# EAGLE design DC-PSx (EAGLE 9.6.2)
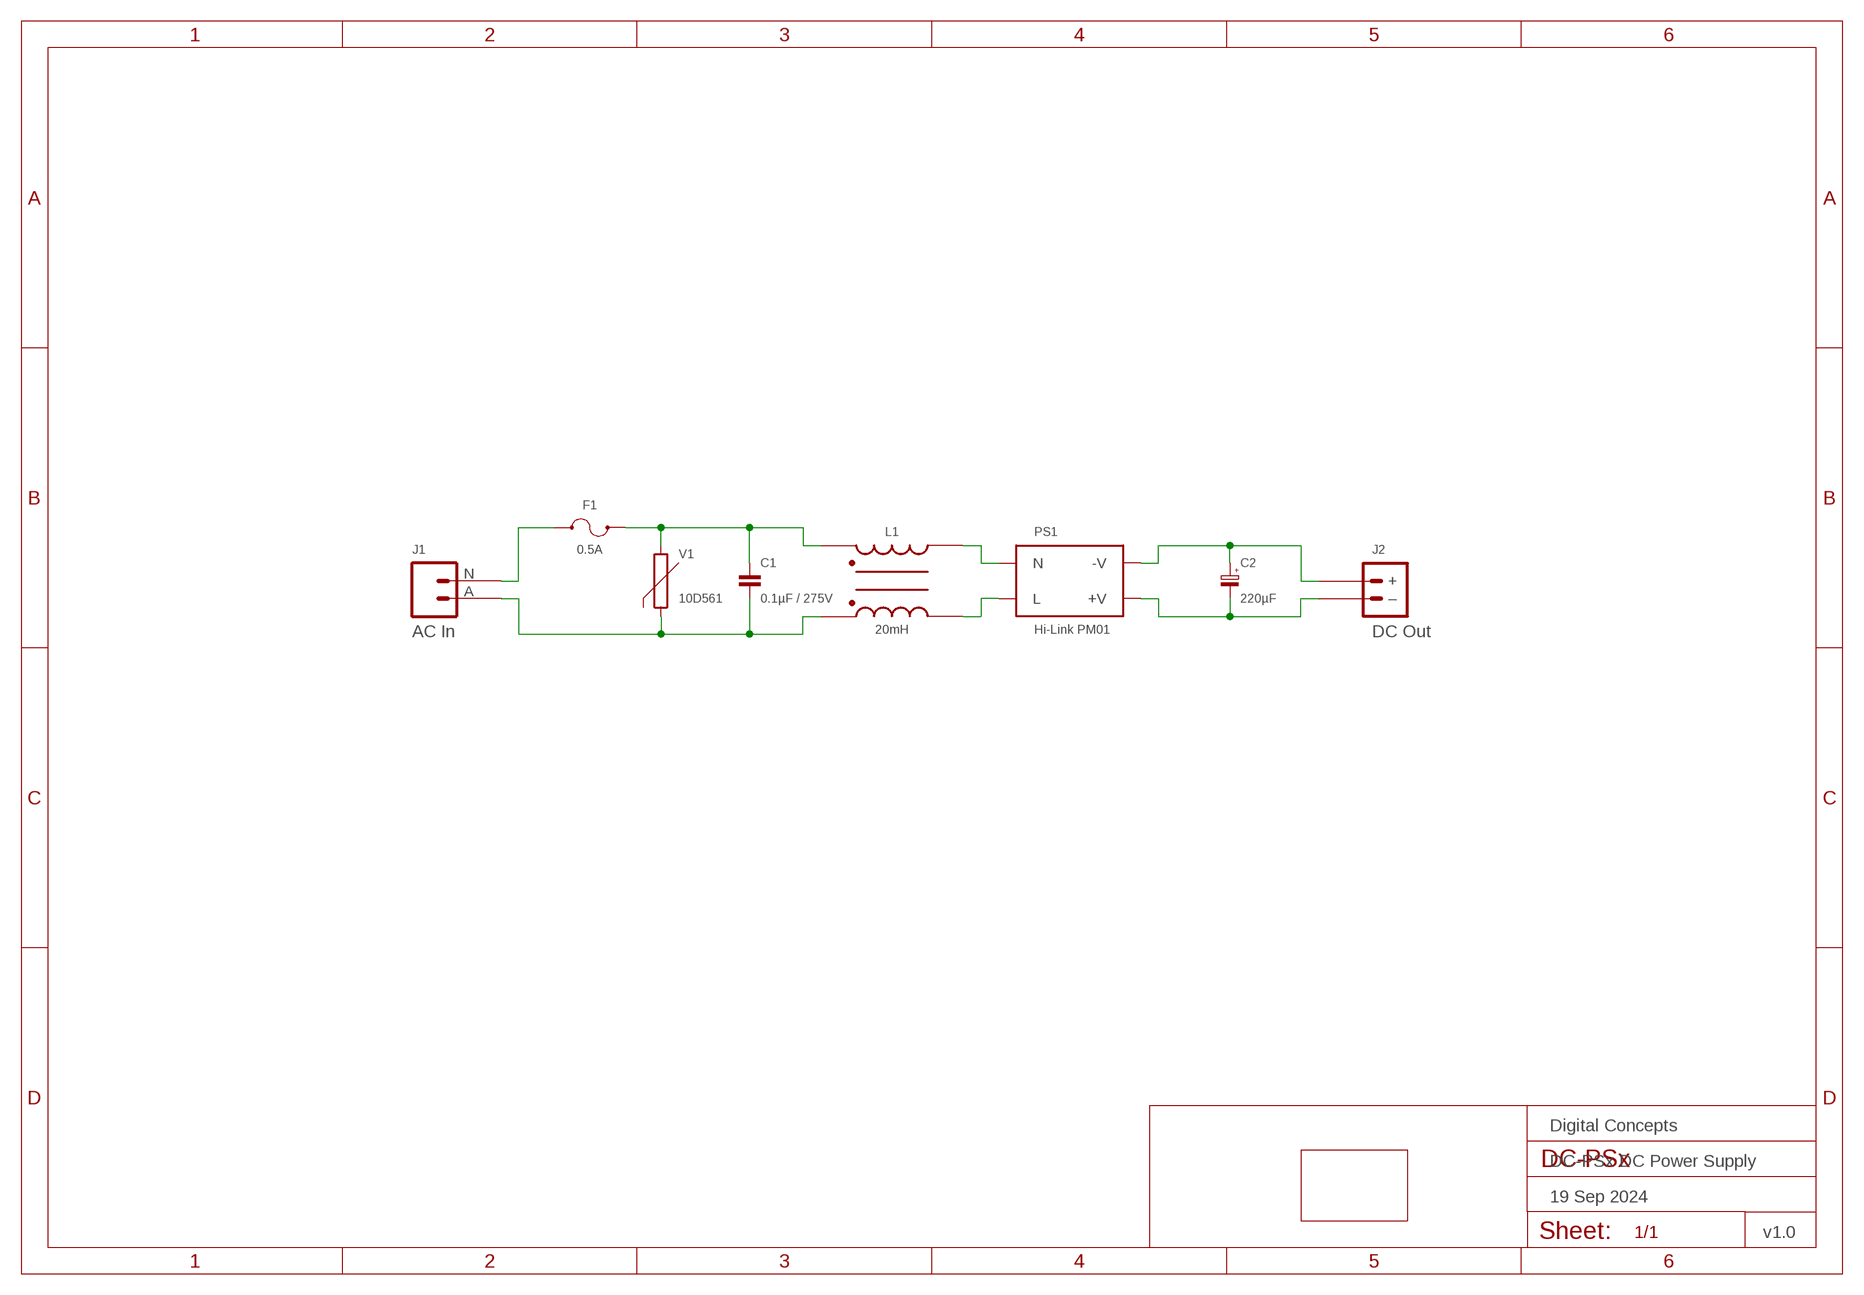
[diagram p0: schematic, sheet 1]
FRAME2 (FRAME-A4L-LOC): DATE: 19 Sep 2024; OWNER: Digital Concepts; TITLE: DC-PSx DC Power Supply; VERSION: v1.0

## Parts
C1  0.1µF / 275V  CAPACITOR-TENTA-SUPPRESSION  [CAPACITOR-TENTA-SUPPRESSION]
C2  220µF  CAPACITOR-ELECTROLYTICE5-10.5  [E5-10,5]
F1  0.5A  FUSE-HOLDER-1808  [FUSE-HOLDER-1808]
J1  AC In  AC_POWER_SOCKET_DB-03  [DB-03_AC_POWER_SOCKET]
J2  DC Out  JST-PH2.0-2-VERTICAL-POWER  [JST-PH2.0-2-VERTICAL-POWER]
L1  20mH  INDUCTOR-COMMON-MODE-UU9.8  [INDUCTOR-UU9.8]
PCB1  PCB-OUTLINE-64X36  [PCB-POWER-SUPPLY-3]
PS1  Hi-Link PM01  POWER_SUPPLY-HI-LINK  [HI-LINK_PM0X]
V1  10D561  VARISTOR-10D561  [VARISTOR-10D561]

## Nets
N$1: F1.P$1 J1.N
N$2: C1.P$1 F1.P$2 L1.P$1 V1.2
N$3: L1.P$2 PS1.AC-N(N)
N$4: C1.P$2 J1.A L1.P$4 V1.1
N$5: L1.P$3 PS1.AC-L(L)
N$6: C2.+ J2.+ PS1.-VO(-V)
N$7: C2.- J2.-(–) PS1.+VO(+V)

## Library data of the parts
C1 = digitalconcepts:CAPACITOR-TENTA-SUPPRESSION: MEX/TENTA Interference Suppression Capacitor
C2 = digitalconcepts:CAPACITOR-ELECTROLYTIC: Electrolytic Capacitor; SPICEPREFIX: C
F1 = digitalconcepts:FUSE-HOLDER-1808: 1808 Fuse Holder
J1 = digitalconcepts:AC_POWER_SOCKET_DB-03: DB-03 AC Power Socket
J2 = digitalconcepts:JST-PH2.0-2-VERTICAL-POWER: JST PH2.0 2P PTH Connector (Power)
L1 = digitalconcepts:INDUCTOR-COMMON-MODE-UU9.8: UU9.8 Common Mode Inductor
PCB1 = digitalconcepts:PCB-OUTLINE-64X36: Power Supply PCB Outline (64 x 36)
PS1 = digitalconcepts:POWER_SUPPLY-HI-LINK: Hi-Link Power Supply Module
V1 = digitalconcepts:VARISTOR-10D561: VARISTOR

## Board
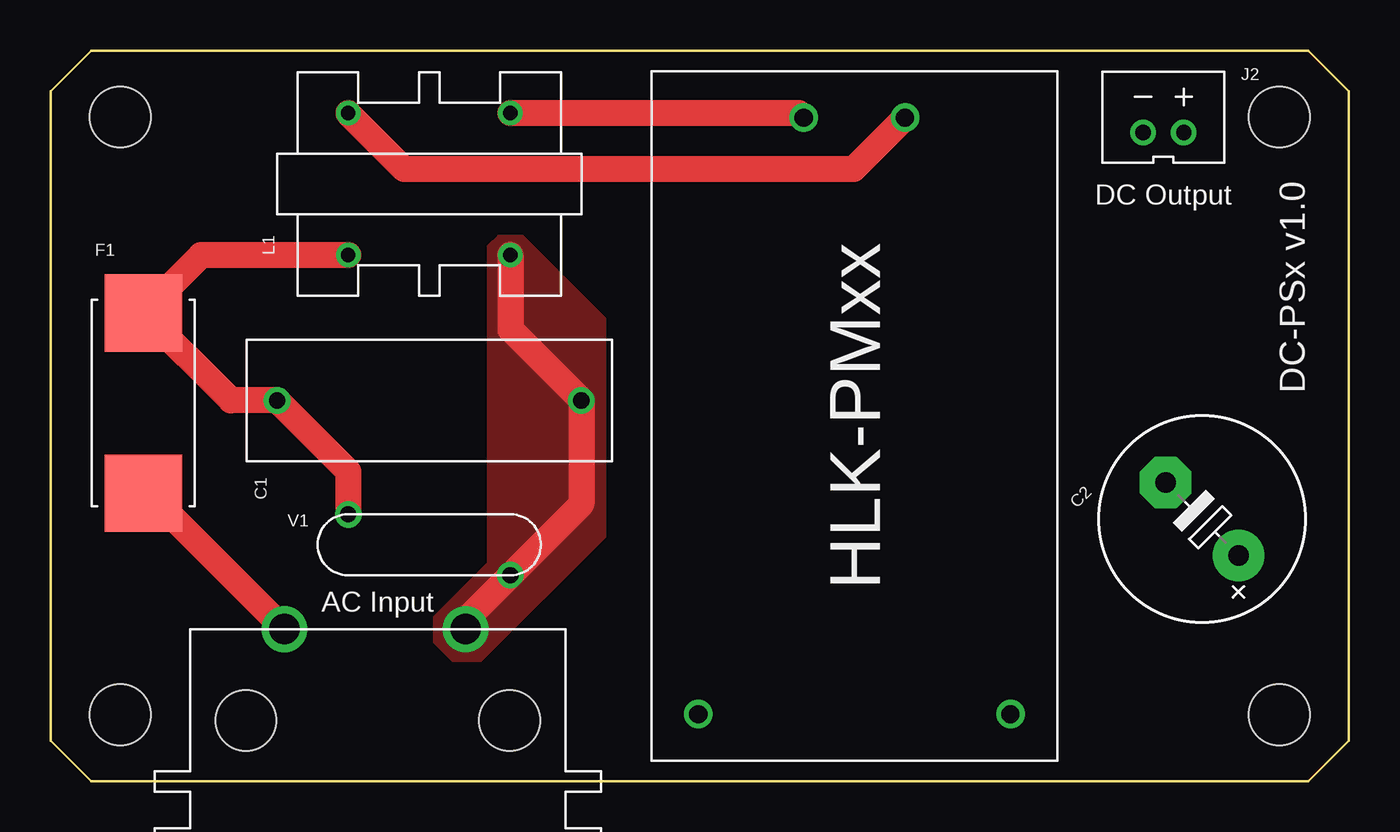
[diagram p1: board, top side]
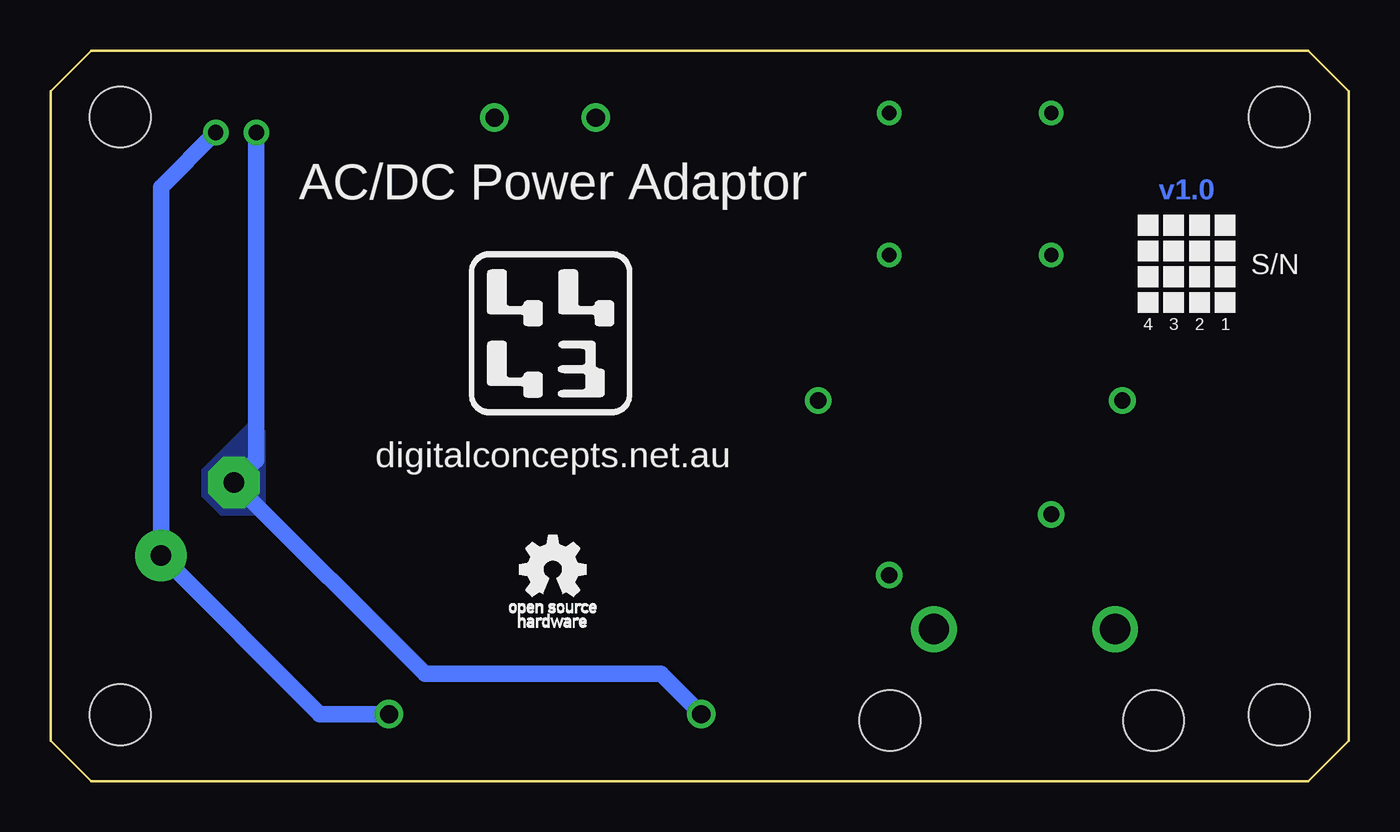
[diagram p2: board, bottom side, seen from below]

Size 64 x 36 mm. Coordinates in mm from the lower left corner, seen from the top.
Copper layers (1*16): Top 0.035mm / dielectric 1.5mm / Bottom 0.035mm
Design rules "default *": minimum track width 6mil, minimum drill 0.35mm, track to track 6mil, track to pad 6mil, pad to pad 6mil, via to via 6mil, smd to smd 6mil, copper to edge 6mil, drill to drill 6mil, minimum pad ring 10mil, minimum via ring 8mil, stop-mask expansion 4mil, vias tented up to drill 0mil, thermal gap 10mil

### Footprints (pad centres in the part's own frame; a part is rotated, then mirrored left to right if it is on the bottom)
CAPACITOR-TENTA-SUPPRESSION = drill 0.8: P$1 -7.5,0; P$2 7.5,0
E5-10,5 = drill 1.016 pad 2.54: + -2.54,0 | drill 1.016 pad 2.54 octagon: - 2.54,0
FUSE-HOLDER-1808 = smd 3.81 x 3.81: P$1 -4.445,0; P$2 4.445,0
DB-03_AC_POWER_SOCKET = drill 1.5: A -4.33,-6; N 4.6,-6 | hole 3: -6.5,-1.5; 6.5,-1.5
JST-PH2.0-2-VERTICAL-POWER = drill 0.75: + -1,0; - 1,0
INDUCTOR-UU9.8 = drill 0.7: P$1 -3.5,4; P$2 3.5,4; P$3 3.5,-4; P$4 -3.5,-4
PCB-POWER-SUPPLY-3 = hole 3: -28.575,14.732; -28.575,-14.732; 28.575,-14.732; 28.575,14.732
HI-LINK_PM0X = drill 0.9: +VO 14.7,-7.7; -VO 14.7,7.7; AC-L -14.7,-2.5; AC-N -14.7,2.5
VARISTOR-10D561 = drill 0.8: 1 -4,1.5; 2 4,-1.5

### Placement (x,y rotation side)
C1  18.66,18.76 0 top
C2  56.77,12.92 135 top
F1  4.57,18.64 90 top
J1  16.12,1.49 180 top
J2  54.86,31.97 180 top
L1  18.66,29.43 90 top
PCB1  32,18 0 top
PS1  39.62,18 270 top
V1  18.66,11.65 180 top

### Tracks (layer width: path | path; a pad name or v marks a point on that pad's centre or on a via)
N$1
  Top 1.27: F1.P$1 4.82,14.19 J1.N
N$2
  Top 1.27: V1.2 14.66,15.26 C1.P$1 8.89,18.76 F1.P$2 7.42,25.93 L1.P$1
N$3
  Top 1.27: PS1.AC-N 39.58,30.16 17.43,30.16 L1.P$2
N$4
  Top 1.27: L1.P$4 22.66,22.26 C1.P$2 26.16,13.65 V1.1 20.45,7.94 J1.A
  pour Top (no thermals): 22.09,26.89 23.24,26.89 27.3,22.83 27.3,12.03 21.2,5.94 19.81,5.94 18.92,6.82 18.92,8.09 21.59,10.76 21.59,26.38
N$5
  Top 1.27: PS1.AC-L 36.89,32.93 L1.P$3
N$6
  Bottom 0.813: PS1.-VO 50.74,3.3 C2.+ 58.56,29.27 J2.+
N$7
  Bottom 0.813: PS1.+VO 33.92,5.3 45.55,5.3 C2.- 53.86,15.83 J2.-
  pour Bottom (no thermals): 53.46,17.24 53.84,17.62 54.23,17.62 56.51,15.33 56.51,14.06 55.62,13.17 53.84,13.17 53.46,13.55

### Text on the board
Bottom: v1.0
tPlace: DC-PSx v1.0
bPlace: AC/DC Power Adaptor | S/N | 1 | 2 | 3 | 4 | digitalconcepts.net.au
tNames: DC Output | AC Input